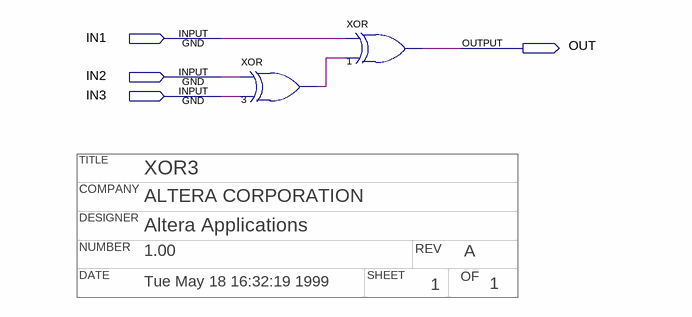
[diagram p0: schematic sheet]
// Quartus schematic xor3.bdf as structural Verilog: 2 symbols, 4 pins
// Title block: TITLE: XOR3; COMPANY: ALTERA CORPORATION; DESIGNER: Altera Applications; NUMBER: 1.00; REV: A; DATE: Tue May 18 16:32:19 1999; SHEET: 1; OF: 1
module xor3 (
  input  IN1,
  input  IN2,
  input  IN3,
  output OUT
);

  wire n3_out;

  xor u_3 (n3_out, IN2, IN3);
  xor u_1 (OUT, IN1, n3_out);
endmodule
